# Altium schematic sheet BLE module.SchDoc
size A
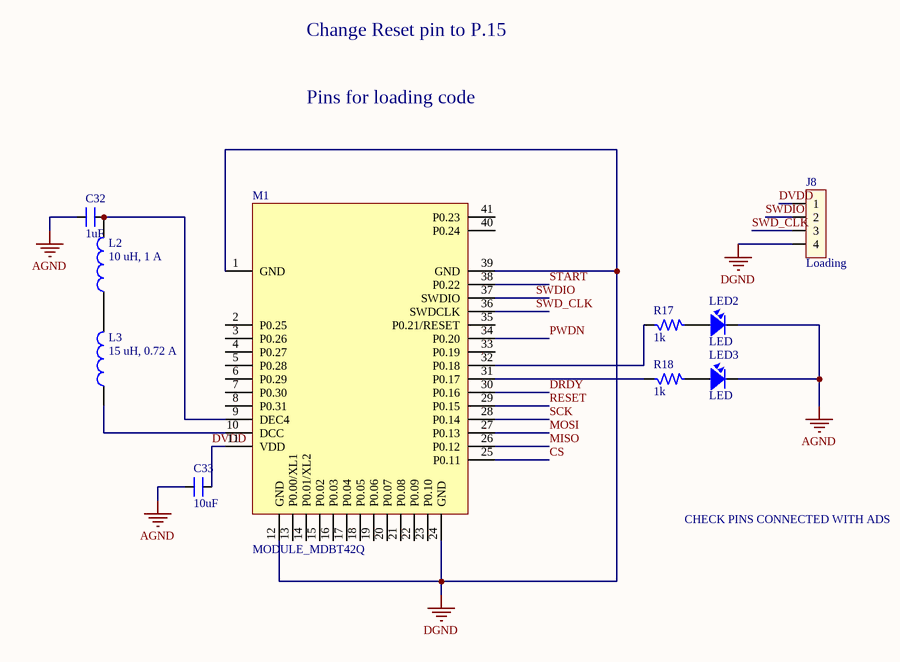
[diagram p0: BLE module.SchDoc]

## Parts
C32  1uF  [SM-0805]
C33  10uF  [SM-0805]
J8  Loading  [JP4]
L2  10 uH, 1 A  [WE-TPC_2828]
L3  15 uH, 0.72 A  [WE-TPC_2828]
LED2  LED  [SM-0805]
LED3  LED  [SM-0805]
M1  MODULE_MDBT42Q  [PCB_MDBT42Q_10X16]
R17  1k  [SM-0805]
R18  1k  [SM-0805]

## Nets
AGND: C32.1 C33.1 LED2.2 LED3.2
DGND: J8.4 M1.1(GND) M1.12(GND) M1.24(GND) M1.39(GND)
CS: M1.25(P0.11)
DRDY: M1.30(P0.16)
DVDD: C33.2 J8.1 M1.11(VDD)
MISO: M1.26(P0.12)
MOSI: M1.27(P0.13)
PWDN: M1.34(P0.20)
RESET: M1.29(P0.15)
SCK: M1.28(P0.14)
START: M1.38(P0.22)
SWD_CLK: J8.3 M1.36(SWDCLK)
SWDIO: J8.2 M1.37(SWDIO)
NetC32_2: C32.2 L2.2 M1.9(DEC4)
NetL2_1: L2.1 L3.2
NetL3_1: L3.1 M1.10(DCC)
NetLED2_1: LED2.1 R17.2
NetLED3_1: LED3.1 R18.2
NetM1_31: M1.31(P0.17) R18.1
NetM1_32: M1.32(P0.18) R17.1

Not connected (* = marked no-connect by the designer): M1 2(P0.25) 3(P0.26) 4(P0.27) 5(P0.28) 6(P0.29) 7(P0.30) 8(P0.31) 13(P0.00/XL1) 14(P0.01/XL2) 15(P0.02) 16(P0.03) 17(P0.04) 18(P0.05) 19(P0.06) 20(P0.07) 21(P0.08) 22(P0.09) 23(P0.10) 33(P0.19) 35(P0.21/RESET) 40(P0.24) 41(P0.23)

## Notes on the sheet
- Change Reset pin to P.15
- Pins for loading code
- CHECK PINS CONNECTED WITH ADS

## Library data of the parts
C32 C33 = CM: Cap SMD; Value: 103
J8 = JP4: Connector 4; Value: Connector 4x2
L2 = 744025100: SMT Shielded Tiny Power Inductor WE-TPC, size 2828, 10 uH, 1 A; Rated Current: 1 A; Inductance: 10 uH; DC Resistance max.: 190 mOhm; Self Resonant Frequency: 41 MHz; Saturation Current: 1.1 A; ComponentLink1Description: Manufacturer; ComponentLink1URL: http://www.we-online.de; ComponentLink2Description: Datasheet; ComponentLink2URL: https://katalog.we-online.com/pbs/datasheet/744025100.pdf; Part Number: 744025100; Published Date: December 2018; Publisher: Wurth Elektronik; Size: 2828; Operating Temperature: -40 to +125 degC; Mounting Technology: SMT; Packaging: Tape and Reel
L3 = 744025150: SMT Shielded Tiny Power Inductor WE-TPC, size 2828, 15 uH, 0.72 A; Rated Current: 0.72 A; Inductance: 15 uH; DC Resistance max.: 400 mOhm; Self Resonant Frequency: 32 MHz; Saturation Current: 0.9 A; ComponentLink1Description: Manufacturer; ComponentLink1URL: http://www.we-online.de; ComponentLink2Description: Datasheet; ComponentLink2URL: https://katalog.we-online.com/pbs/datasheet/744025150.pdf; Part Number: 744025150; Published Date: December 2018; Publisher: Wurth Elektronik; Size: 2828; Operating Temperature: -40 to +125 degC; Mounting Technology: SMT; Packaging: Tape and Reel
LED2 LED3 = LED: LED Single colour Green and Red; Value: LED 3 ly Single Colour
M1 = MODULE_MDBT42Q: MDBT42Q
R17 R18 = R: Resistor 1/4W; Value: R1/4W - 1K